# Altium schematic sheet MPPT CC CV charger (B).SchDoc
size A4; SheetNumber: 3; SheetTotal: 8
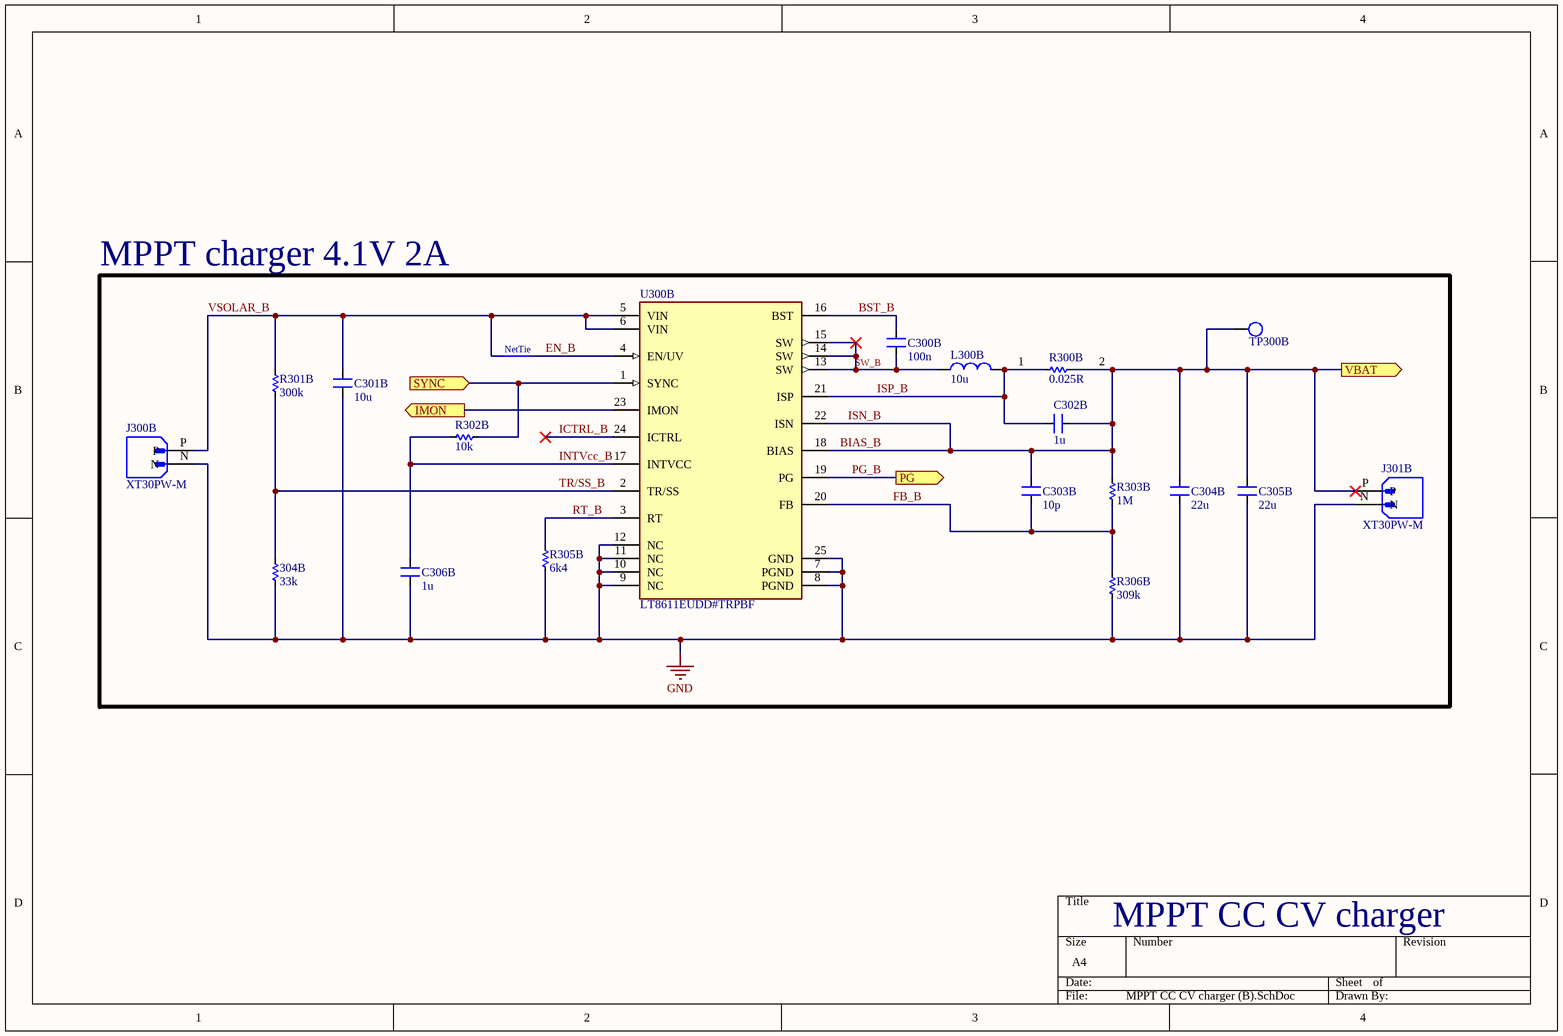
[diagram p0: MPPT CC CV charger (B).SchDoc]

## Parts
304B  33k  [RES-SMD-0603]
C300B  100n  [CN-SMD-0603]
C301B  10u  [CN-SMD-0603]
C302B  1u  [CN-SMD-0603]
C303B  10p  [CN-SMD-0603]
C304B  22u  [CN-SMD-0603]
C305B  22u  [CN-SMD-0603]
C306B  1u  [CN-SMD-0603]
J300B  XT30PW-M  [AMASS_XT30PW-M]
J301B  XT30PW-M  [AMASS_XT30PW-M]
L300B  10u  [L-SMD-M-7.3x4.5]
R300B  0.025R  [RES-SMD-0603]
R301B  300k  [RES-SMD-0603]
R302B  10k  [RES-SMD-0603]
R303B  1M  [RES-SMD-0603]
R305B  6k4  [RES-SMD-0603]
R306B  309k  [RES-SMD-0603]
TP300B  Test-Point  [TESTPOINT]  (value not drawn)
U300B  LT8611EUDD#TRPBF  [FP-UDD-24-05-08-1833-IPC_B]

## Ports
IMON (out, see MPPT CC CV charger (A)[2B]), PG (out, see Buck-Boost converter (A)[3C], Buck-Boost converter (B)[3B], MPPT CC CV charger (A)[3B]), SYNC (in, see MPPT CC CV charger (A)[2B]), VBAT (out, see MPPT CC CV charger (A)[4B])

## Nets
GND: 304B.1 C301B.1 C304B.1 C305B.1 C306B.1 J300B.N J301B.N R305B.1 R306B.2 U300B.7(PGND) U300B.8(PGND) U300B.9(NC) U300B.10(NC) U300B.11(NC) U300B.12(NC) U300B.25(GND)
BIAS_B: C302B.2 C303B.2 C304B.2 C305B.2 J301B.P R300B.1 R303B.1 TP300B.1 U300B.18(BIAS) U300B.22(ISN) ; port VBAT  [also labelled ISN_B]
BST_B: C300B.2 U300B.16(BST)
EN_B: C301B.2 J300B.P R301B.2 U300B.4(EN/UV) U300B.5(VIN) U300B.6(VIN)  [also labelled VSOLAR_B]
FB_B: C303B.1 R303B.2 R306B.1 U300B.20(FB)
ICTRL_B: U300B.24(ICTRL)
IMON: U300B.23(IMON) ; port IMON
INTVcc_B: C306B.2 R302B.2 U300B.17(INTVCC)
ISP_B: C302B.1 L300B.2 R300B.2 U300B.21(ISP)
PG_B: U300B.19(PG) ; port PG
RT_B: R305B.2 U300B.3(RT)
SW_B: C300B.1 L300B.1 U300B.13(SW) U300B.14(SW) U300B.15(SW)
SYNC: R302B.1 U300B.1(SYNC) ; port SYNC
TR/SS_B: 304B.2 R301B.1 U300B.2(TR/SS)

## Notes on the sheet
- MPPT charger 4.1V 2A
- NetTie
- 1
- (near R300B) 2
- MPPT CC CV charger

## Library data of the parts
304B R300B R301B R302B R303B R305B R306B = Res-SMD: Resistor; Manufacturer: Generic Components; Class: Passive; Published: 08/06/2000; Publisher: Altium Hobart Technology Centre
C300B C301B C302B C303B C304B C305B C306B = CN: Value: 33pF
J300B J301B = XT30PW-M: Socket; DC supply; XT30; male; PIN: 2; on PCBs; THT; Colour: yellow; MF: AMASS; SnapEDA_Link: https://www.snapeda.com/parts/XT30PW-M/AMASS/view-part/?ref=snap; Package: None; Value: *; MP: XT30PW-M; Check_prices: https://www.snapeda.com/parts/XT30PW-M/AMASS/view-part/?ref=eda
L300B = L-SMD-1: partNo: 78477010; Manufacturer: Wurth Elektronik; Inductance: 1.0 μH; ComponentLink1Description: Manufacturer; ComponentLink1URL: http://www.we-online.de; Created by: Baojun Chen; Created Date: Nov.2015; ComponentLink2Description: Datasheet; ComponentLink2URL: http://katalog.we-online.de/pbs/datasheet/78477010.pdf
U300B = CMP-0491-02169-2: IC REG BUCK ADJ 2.5A 24QFN; Synchronous Rectifier: Yes; Number of Outputs: 1; Output Type: Adjustable; Switching Frequency: 2MHz; Efficiency: 96%; Output Voltage: 40V; Max Operating Temperature: 125°C; Output Current: 2.5A; RoHS Compliant: Yes; Case/Package: QFN; Package Quantity: 2500; Lead Free: Lead Free; Series: -; Number of Pins: 24; Min Operating Temperature: -40°C; Packaging: Tape and Reel